# Altium schematic sheet MCU_old.SchDoc: MCU
size A4; Date: 24/11/2015; Author: Samuel López; DocumentNumber: 1; SheetNumber: 1; SheetTotal: 2; Project: H2H Main Board
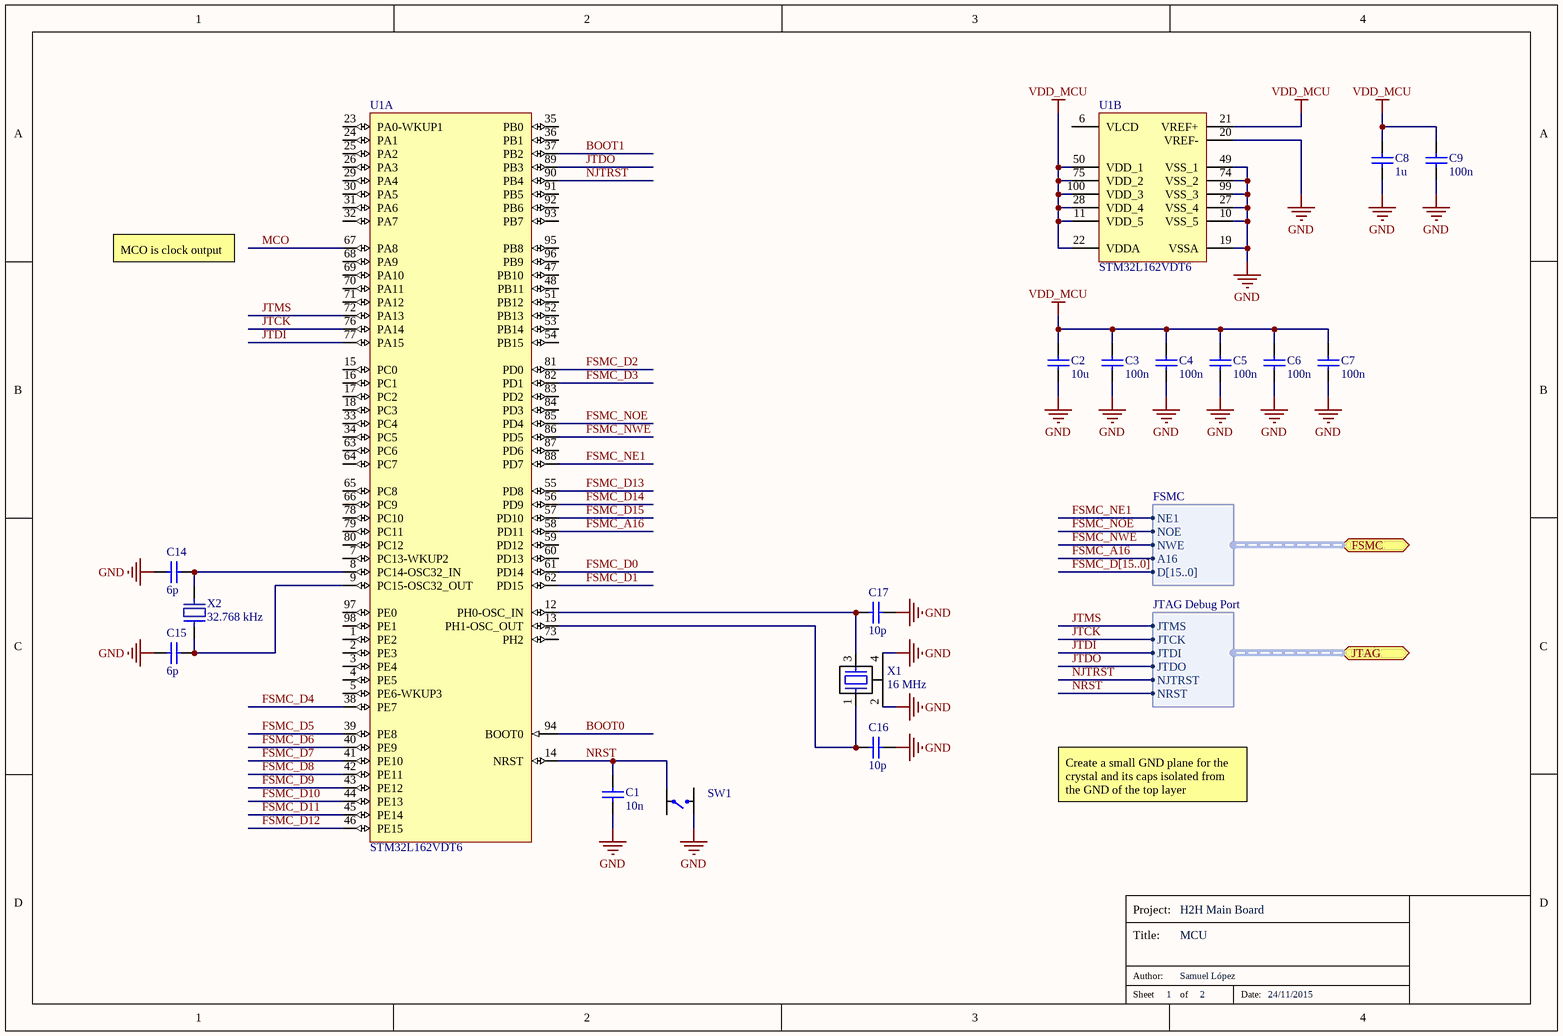
[diagram p0: MCU_old.SchDoc]

## Parts
C1  10n  [C0603]
C2  10u  [C0603]
C3  100n  [C0603]
C4  100n  [C0603]
C5  100n  [C0603]
C6  100n  [C0603]
C7  100n  [C0603]
C8  1u  [C0603]
C9  100n  [C0603]
C14  6p  [C0603]
C15  6p  [C0603]
C16  10p  [C0603]
C17  10p  [C0603]
SW1  EVQ-Q2K01W  [EVQ-Q2K01W]  (value not drawn)
U1  STM32L162VDT6  [STM-LQFP100_N]  (parts A,B of 2)
X1  Frequency: 16 MHz  [ABM3B-16.000MHZ-10-1-U]  (hidden comment: ABM3B-16.000MHZ-10-1-U)
X2  Frequency: 32.768 kHz  [ABS07-120-32.768KHZ-T]  (hidden comment: ABS07-120-32.768KHZ-T)

## Ports
FSMC (harness FSMC), JTAG (harness JTAG Debug Port)

## Harnesses
FSMC: NE1, NOE, NWE, A16, D[15..0]
JTAG Debug Port: JTMS, JTCK, JTDI, JTDO, NJTRST, NRST

## Nets
GND: C1.1 C2.1 C3.1 C4.1 C5.1 C6.1 C7.1 C8.1 C9.1 C14.1 C15.1 C16.1 C17.1 SW1.3(B2) U1.10(VSS_5) U1.19(VSSA) U1.20(VREF-) U1.27(VSS_4) U1.49(VSS_1) U1.74(VSS_2) U1.99(VSS_3) X1.2 X1.4
VDD_MCU: C2.2 C3.2 C4.2 C5.2 C6.2 C7.2 C8.2 C9.2 U1.11(VDD_5) U1.21(VREF+) U1.22(VDDA) U1.28(VDD_4) U1.50(VDD_1) U1.75(VDD_2) U1.100(VDD_3)
BOOT0: U1.94(BOOT0)
BOOT1: U1.37(PB2)
FSMC_A16: U1.58(PD11) ; port FSMC.A16
FSMC_D0: U1.61(PD14)
FSMC_D1: U1.62(PD15)
FSMC_D2: U1.81(PD0)
FSMC_D3: U1.82(PD1)
FSMC_D4: U1.38(PE7)
FSMC_D5: U1.39(PE8)
FSMC_D6: U1.40(PE9)
FSMC_D7: U1.41(PE10)
FSMC_D8: U1.42(PE11)
FSMC_D9: U1.43(PE12)
FSMC_D10: U1.44(PE13)
FSMC_D11: U1.45(PE14)
FSMC_D12: U1.46(PE15)
FSMC_D13: U1.55(PD8)
FSMC_D14: U1.56(PD9)
FSMC_D15: U1.57(PD10)
FSMC_NE1: U1.88(PD7) ; port FSMC.NE1
FSMC_NOE: U1.85(PD4) ; port FSMC.NOE
FSMC_NWE: U1.86(PD5) ; port FSMC.NWE
JTCK: U1.76(PA14) ; port JTAG.JTCK
JTDI: U1.77(PA15) ; port JTAG.JTDI
JTDO: U1.89(PB3) ; port JTAG.JTDO
JTMS: U1.72(PA13) ; port JTAG.JTMS
MCO: U1.67(PA8)
NJTRST: U1.90(PB4) ; port JTAG.NJTRST
NRST: C1.2 SW1.1(A1) U1.14(NRST) ; port JTAG.NRST
NetC14_2: C14.2 U1.8(PC14-OSC32_IN) X2.1
NetC15_2: C15.2 U1.9(PC15-OSC32_OUT) X2.2
NetC16_2: C16.2 U1.13(PH1-OSC_OUT) X1.1
NetC17_2: C17.2 U1.12(PH0-OSC_IN) X1.3

Not connected (* = marked no-connect by the designer): SW1 2(A2) 4(B1); U1 1(PE2) 2(PE3) 3(PE4) 4(PE5) 5(PE6-WKUP3) 6(VLCD) 7(PC13-WKUP2) 15(PC0) 16(PC1) 17(PC2) 18(PC3) 23(PA0-WKUP1) 24(PA1) 25(PA2) 26(PA3) 29(PA4) 30(PA5) 31(PA6) 32(PA7) 33(PC4) 34(PC5) 35(PB0) 36(PB1) 47(PB10) 48(PB11) 51(PB12) 52(PB13) 53(PB14) 54(PB15) 59(PD12) 60(PD13) 63(PC6) 64(PC7) 65(PC8) 66(PC9) 68(PA9) 69(PA10) 70(PA11) 71(PA12) 73(PH2) 78(PC10) 79(PC11) 80(PC12) 83(PD2) 84(PD3) 87(PD6) 91(PB5) 92(PB6) 93(PB7) 95(PB8) 96(PB9) 97(PE0) 98(PE1)

## Buses and harness runs
bus FSMC_D[15..0]

## Notes on the sheet
- MCO is clock output
- Create a small GND plane for the
  crystal and its caps isolated from
  the GND of the top layer
- Project:
- Title:
- Sheet
- Author:
- of
- Date:

## Library data of the parts
C1-C9 C14-C17 = Capacitor: Rated Voltage: *
  C1: Value: 10n
  C2: Value: 10u
  C3-C7 C9: Value: 100n
  C8: Value: 1u
  C14 C15: Value: 6p
  C16 C17: Value: 10p
SW1 = EVQ-Q2K01W: Switch - SPST Off-Mom; Supplier 1: Digi-Key; Supplier Part Number 1: P12941SCT-ND
U1 = STM32L162VDT6: ARM Cortex-M3 32-bit MCU, 384 KB Flash, 48 KB Internal RAM, 83 I/Os, 100-pin LQFP, -40 to 85 degC, Tray; Manufacturer: STMicroelectronics; D/A Converter: 2x12-bit (2 Channel); Data E2PROM nom (B): 12288; Display controller: LCD 4x44/8x40; FLASH Size (Prog) (kB): 384; I/Os (High Current): 83; Integrated op-amps: 3; Internal RAM Size (kB): 48; Operating Frequency(F) (Processor speed) (MHz): 32; Supply Voltage(Vcc) min (V): 1.65; DatasheetVersion: Rev. 4; PackageVersion: Rev. 1, 06/2013; PackageReference: LQFP100; PackageDescription: 100-Pin Low Profile Quad Flat Package, 14 x 14 mm Body, 0.5 mm Pitch; Core: ARM Cortex-M3; Packing: Tray; Mounting Technology: Surface Mount; PartNumber: STM32L162VDT6; ComponentLink1Description: Manufacturer URL; ComponentLink1URL: http://www.st.com/web/en/home.html; ComponentLink2Description: Datasheet; ComponentLink2URL: http://www.st.com/st-web-ui/static/active/en/resource/technical/document/datasheet/DM00039232.pdf; ComponentLink3Description: Package Specification; ComponentLink3URL: http://www.st.com/st-web-ui/static/active/en/resource/technical/document/data_brief/DM00071938.pdf
X1 = ABM3B-16.000MHZ-10-1-U: Crystal - 16 MHz; Load Capacitance: 10 pF; ESR: 50 m; Supplier 1: Digi-Key; Supplier Part Number 1: 300-8206-1-ND
X2 = ABS07-120-32.768KHZ-T: Crystal - 32.768 kHz; Load Capacitance: 6 pF; Supplier 1: Digi-Key; Supplier Part Number 1: 535-11937-1-ND